# Altium project AMC_FMC_Carrier.PrjPcb (part 7 of 7)

## Sheet SUP_1.5_VTT.SchDoc
size A4
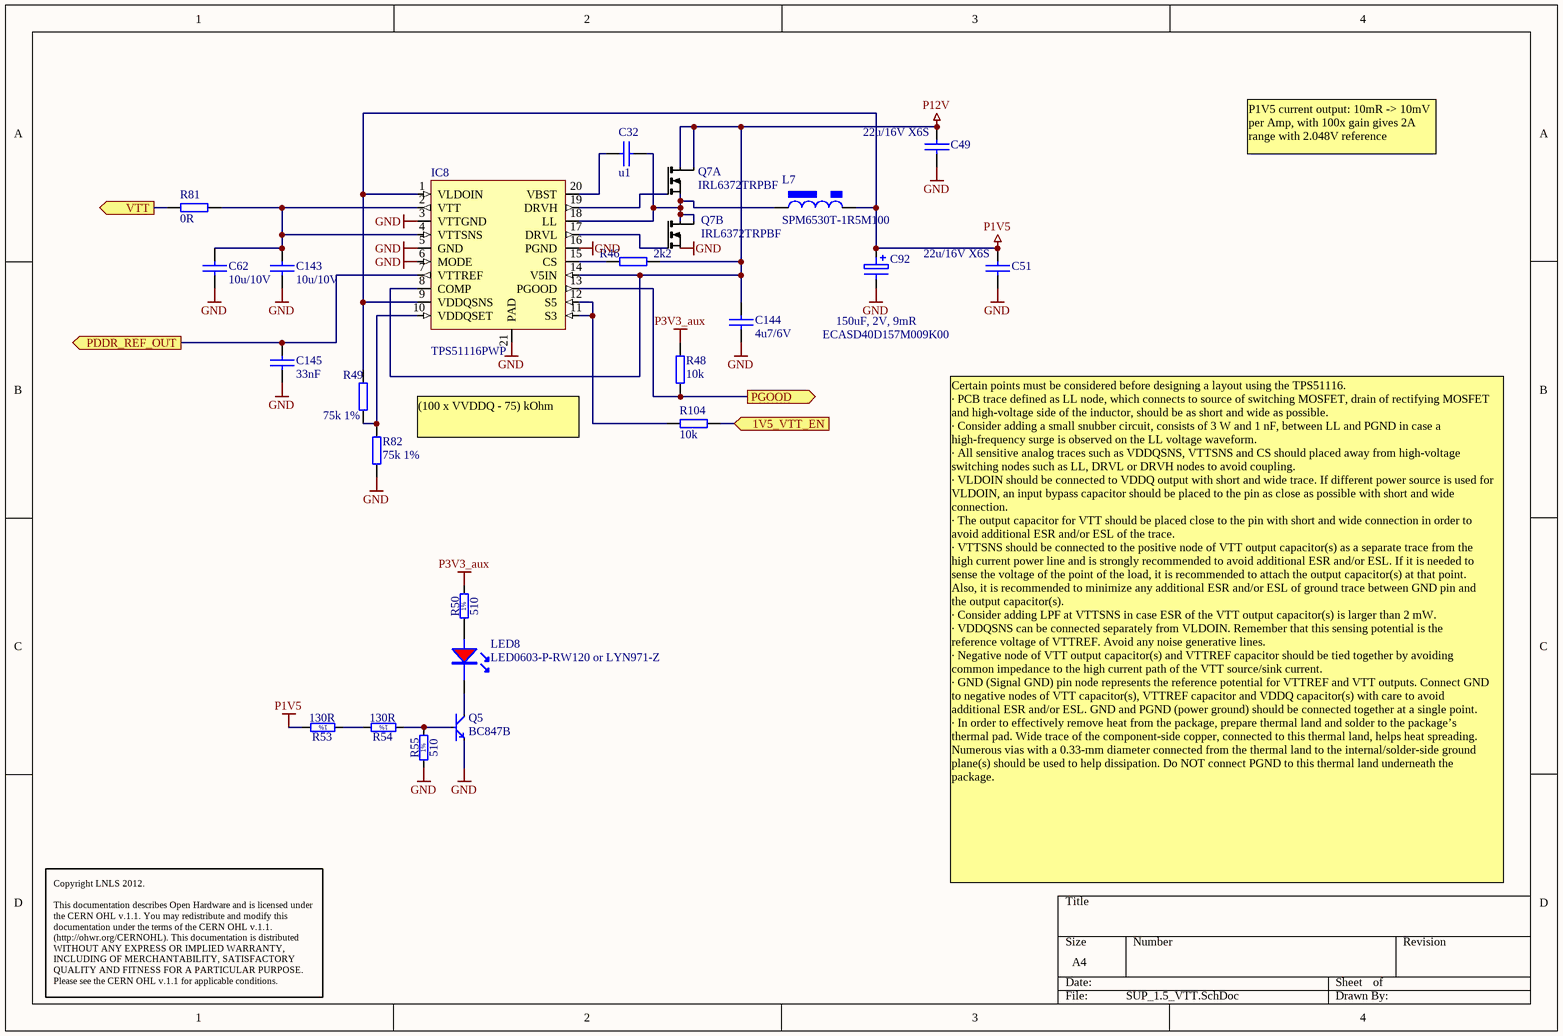
[diagram p20: SUP_1.5_VTT.SchDoc]

### Parts
(Parts that share a designator on the sheet are numbered #1, #2 ... from top to bottom, then left to right.)
C32  u1  [0402C]
C49  22u/16V X6S  [1206C]
C51  22u/16V X6S  [1206C]
C62  10u/10V  [0805C]
C92  ECASD40D157M009K00  value 150uF, 2V, 9mR  [2917_POLY]
C143  10u/10V  [0805C]
C144  4u7/6V  [0603C]
C145  33nF  [0603C]
IC8#2  TPS51116PWP  [TSSOP20-TP]
L7  SPM6530T-1R5M100  [IND_TDK_SPM6530]
LED8  LED0603-P-RW120 or LYN971-Z  [led_0603R]
Q5#2  BC847B  [SOT-23]
Q7  IRL6372TRPBF  [so-8]  (parts A,B of 2)
R46#2  2k2  [0402R]
R48#2  10k  [0402R]
R49#2  75k 1%  [0603R]
R50#2  510  [0603R]
R53#2  130R  [0603R]
R54#2  130R  [0603R]
R55#2  510  [0603R]
R81#2  0R  [0603R]
R82#2  75k 1%  [0603R]
R104#2  10k  [0402R]

### Ports
1V5_VTT_EN (in), PDDR_REF_OUT (out), PGOOD (out), VTT (out)

### Nets
GND: C49.2 C51.2 C62.2 C92.2 C143.2 C144.2 C145.2 IC8#2.3(VTTGND) IC8#2.5(GND) IC8#2.6(MODE) IC8#2.16(PGND) IC8#2.21(PAD) Q5#2.2(E) Q7.3(S2) R55#2.1 R82#2.1
P1V5: C51.1 C92.1 IC8#2.1(VLDOIN) IC8#2.9(VDDQSNS) L7.2 R49#2.1 R53#2.2
P3V3_aux: R48#2.2 R50#2.2
P12V: C49.1 C144.1 IC8#2.8(COMP) IC8#2.14(V5IN) Q7.7(D1) Q7.8(D1) R46#2.2
1V5_VTT_EN: R104#2.2 ; port 1V5_VTT_EN
PDDR_REF_OUT: C145.1 IC8#2.7(VTTREF) ; port PDDR_REF_OUT
PGOOD: IC8#2.13(PGOOD) R48#2.1 ; port PGOOD
VTT: R81#2.1 ; port VTT
NetC32_1: C32.1 IC8#2.20(VBST)
NetC32_2: C32.2 IC8#2.18(LL) L7.1 Q7.1(S1) Q7.5(D2) Q7.6(D2)
NetC62_1: C62.1 C143.1 IC8#2.2(VTT) IC8#2.4(VTTSNS) R81#2.2
NetIC8#2_10: IC8#2.10(VDDQSET) R49#2.2 R82#2.2
NetIC8#2_11: IC8#2.11(S3) IC8#2.12(S5) R104#2.1
NetIC8#2_15: IC8#2.15(CS) R46#2.1
NetIC8#2_17: IC8#2.17(DRVL) Q7.4(G2)
NetIC8#2_19: IC8#2.19(DRVH) Q7.2(G1)
NetLED8_A: LED8.A R50#2.1
NetLED8_K: LED8.K Q5#2.3(C)
NetQ5#2_1: Q5#2.1(B) R54#2.1 R55#2.2
NetR53#2_1: R53#2.1 R54#2.2

### Notes on the sheet
- P1V5 current output: 10mR -> 10mV per Amp, with 100x gain gives 2A range with 2.048V reference
- (100 x VVDDQ - 75) kOhm
- Certain points must be considered before designing a layout using the TPS51116.
  · PCB trace defined as LL node, which connects to source of switching MOSFET, drain of rectifying MOSFET
  and high-voltage side of the inductor, should be as short and wide as possible.
  · Consider adding a small snubber circuit, consists of 3 W and 1 nF, between LL and PGND in case a
  high-frequency surge is observed on the LL voltage waveform.
  · All sensitive analog traces such as VDDQSNS, VTTSNS and CS should placed away from high-voltage
  switching nodes such as LL, DRVL or DRVH nodes to avoid coupling.
  · VLDOIN should be connected to VDDQ output with short and wide trace. If different power source is used for
  VLDOIN, an input bypass capacitor should be placed to the pin as close as possible with short and wide
  connection.
  · The output capacitor for VTT should be placed close to the pin with short and wide connection in order to
  avoid additional ESR and/or ESL of the trace.
  · VTTSNS should be connected to the positive node of VTT output capacitor(s) as a separate trace from the
  high current power line and is strongly recommended to avoid additional ESR and/or ESL. If it is needed to
  sense the voltage of the point of the load, it is recommended to attach the output capacitor(s) at that point.
  Also, it is recommended to minimize any additional ESR and/or ESL of ground trace between GND pin and
  the output capacitor(s).
  · Consider adding LPF at VTTSNS in case ESR of the VTT output capacitor(s) is larger than 2 mW.
  · VDDQSNS can be connected separately from VLDOIN. Remember that this sensing potential is the
  reference voltage of VTTREF. Avoid any noise generative lines.
  · Negative node of VTT output capacitor(s) and VTTREF capacitor should be tied together by avoiding
  common impedance to the high current path of the VTT source/sink current.
  · GND (Signal GND) pin node represents the reference potential for VTTREF and VTT outputs. Connect GND
  to negative nodes of VTT capacitor(s), VTTREF capacitor and VDDQ capacitor(s) with care to avoid
  additional ESR and/or ESL. GND and PGND (power ground) should be connected together at a single point.
  · In order to effectively remove heat from the package, prepare thermal land and solder to the package’s
  thermal pad. Wide trace of the component-side copper, connected to this thermal land, helps heat spreading.
  Numerous vias with a 0.33-mm diameter connected from the thermal land to the internal/solder-side ground
  plane(s) should be used to help dissipation. Do NOT connect PGND to this thermal land underneath the
  package.
- Copyright LNLS 2012.
  This documentation describes Open Hardware and is licensed under the CERN OHL v.1.1. You may redistribute and modify this documentation under the terms of the CERN OHL v.1.1. (http://ohwr.org/CERNOHL). This documentation is distributed WITHOUT ANY EXPRESS OR IMPLIED WARRANTY, INCLUDING OF MERCHANTABILITY, SATISFACTORY QUALITY AND FITNESS FOR A PARTICULAR PURPOSE. Please see the CERN OHL v.1.1 for applicable conditions.
- (in symbol R0402_510R_1%_0.0625W_100PPM) 1%
- (in symbol R0603_130R_1%_0.1W_100PPM) 1%

### Library data of the parts
C32 = CAP_SMD_0402: Capacitor SMD
C49 C51 = CAP_SMD_1206: Capacitor SMD; Supplier 1: Newark; Supplier Part Number 1: 90R7810
C62 C143 = CAP_SMD_0805: Capacitor SMD
C92 = CAP_POLYMER_SMDD: POLY, 150uF, 2V, ESR: 9mR
C144 C145 = CAP_SMD_0603: Capacitor SMD
IC8#2 = PM_TPS51116: COMPLETE DDR AND DDR2 MEMORY POWER SOLUTION
L7 = L_POWER_SPM6530T: 1.5uH, 20%, 10mR, 11.5A; Supplier 1: Arrow; Supplier Part Number 1: 51419938S48550N1165
LED8 = LED_0603R: LED 0603 red; Supplier 1: Newark; Supplier Part Number 1: 22M3004; Supplier 2: Newark; Supplier Part Number 2: 20M0618
Q5#2 = Q_BC847B: Transistor
Q7 = Q_IRL6372: dual NMOS 30V, 8A, 18mR
R46#2 R48#2 R104#2 = RES_0402: SMD Resistor; Supplier 1: Newark; Supplier Part Number 1: 59M6691
R49#2 R81#2 R82#2 = RES_0603: SMD Resistor
R50#2 R55#2 = R0402_510R_1%_0.0625W_100PPM: Resistor - 1%; Part Description: General Purpose Thick Film Chip Resistor; Manufacturer: GENERIC; Manufacturer1 Part Number: 232270675101; TC: ±100ppm/°C; Table: Resistors SMD; Part Number: R0402_510R_1%_0.0625W_100PPM; Component Kind: Standard; Component Type: Standard; Footprint: RESC1005X40N; Pin Count: 2; Value: 510; Status: Not recommended; Power: 0.0625W; Tolerance: ±1%; Manufacturer Part Number: R0402_510R_1%_0.0625W_100PPM; Case: 0402; Mounted: Yes; Socket: No; SMD: Yes; Manufacturer1 Example: PHYCOMP; Manufacturer1 ComponentHeight: 0.4mm; HelpURL: \\cern.ch\dfs\Applications\Altium\Datasheets\R0402_Phycomp_RC0402.pdf; Author: CERN DEM JLC; CreateDate: 2007-12-03; LatestRevisionDate: 2008-03-13
R53#2 R54#2 = R0603_130R_1%_0.1W_100PPM: Resistor - 1%; Part Description: General Purpose Thick Film Chip Resistor; Manufacturer: GENERIC; Manufacturer1 Part Number: NRC06F1300TRF; Value: 130; Power: 0.1W; TC: ±100ppm/°C; Table: Resistors SMD; Part Number: R0603_130R_1%_0.1W_100PPM; Component Kind: Standard; Component Type: Standard; Footprint: RESC1608X55N; Pin Count: 2; Status: Preferred; Tolerance: ±1%; Manufacturer Part Number: R0603_130R_1%_0.1W_100PPM; Case: 0603; Mounted: Yes; Socket: No; SMD: Yes; Manufacturer1 Example: NIC COMPONENT; Manufacturer1 ComponentHeight: 0.55mm; HelpURL: \\cern.ch\dfs\Applications\Altium\Datasheets\R0603_NIC_NRC.pdf; Author: CERN DEM JLC; CreateDate: 2007-12-03; LatestRevisionDate: 2008-03-13

## Nets that join several sheets
GND: AMC_Connector (61 pins), FPGA (18 pins), FPGA_SDRAM (5 pins), Power_Management (6 pins), SUP_2.5_FMC (38 pins), SUP_3.3_FMC (34 pins), SUP_1.5_3.3 (44 pins), SUP_1V (40 pins), UI_mon (14 pins), Connector_Power (11 pins), IPMI (13 pins), CPU (41 pins), Thermometers (16 pins), IPMI/UUART (13 pins), JTAG_Configuration (39 pins), RTM_CON (89 pins), Clock_management (58 pins), Clock_WR (31 pins), UUART (13 pins), FMC_Clocks (8 pins), SUP_1.5_VTT (16 pins)
P1V0: SUP_1V (23 pins), UI_mon (L?#1.1)
P1V5: FPGA (C774.1 IC71.1 IC71.8), SUP_1.5_3.3 (11 pins), SUP_1.5_VTT (7 pins)
P3V3: FPGA (21 pins), SUP_1.5_3.3 (11 pins), UI_mon (R?#7.2), Connector_Power (R343.1 R344.1), JTAG_Configuration (R164.2 R225.2), Clock_management (10 pins), Clock_WR (5 pins)
P3V3MP: AMC_Connector (D?#1.5 D?#2.5 D?#3.5 P1.4), Power_Management (F?#1.1), SUP_2.5_FMC (C475.2 C476.1 IC11.6 IC11.11), SUP_1.5_3.3 (R76.1), SUP_1V (R110.2), UI_mon (L17.1), Connector_Power (6 pins), IPMI (10 pins), CPU (50 pins), Thermometers (19 pins), JTAG_Configuration (14 pins), Clock_management (C766.1 IC56.2)
P12V: AMC_Connector (8 pins), Power_Management (C88.1 D5.1), SUP_2.5_FMC (11 pins), SUP_3.3_FMC (11 pins), SUP_1.5_3.3 (11 pins), SUP_1V (18 pins), UI_mon (R?#6.2), Connector_Power (12 pins), SUP_1.5_VTT (7 pins)
PVADJ1: FPGA (6 pins), SUP_2.5_FMC (5 pins)
PVADJ2: FPGA (C773.1 IC70.1 IC70.8), SUP_2.5_FMC (5 pins), Clock_management (7 pins)
VREF: FPGA_SDRAM (8 pins), SUP_1.5_3.3 (C548.2 IC44.6)
VTT: FPGA_SDRAM (R143.1 R181.1), SUP_1.5_3.3 (C544.2 C545.2 IC44.3 R286.1)
AJTAG.TCK: AMC_Connector (D?#1.6 P1.165), JTAG_Configuration (R231.1)
AJTAG.TDI: AMC_Connector (D?#1.1 P1.169), JTAG_Configuration (R230.1)
AJTAG.TDO: AMC_Connector (D?#1.4 P1.168), JTAG_Configuration (R229.1)
AJTAG.TMS: AMC_Connector (D?#2.1 P1.166), JTAG_Configuration (R227.1)
AJTAG.TRST#: AMC_Connector (D?#2.3 P1.167), JTAG_Configuration (R226.1)
EN_I2C_RTM: IPMI (IC72.8 R121.2), CPU (IC6.30)
FCLKA_N: AMC_Connector (P1.81), Clock_management (C395.1)
FCLKA_P: AMC_Connector (P1.80), Clock_management (C393.1)
FJTAG.TCK: FPGA (IC2#1.AE12), JTAG_Configuration (IC47.59 R164.1)
FJTAG.TDI: FPGA (IC2#1.AE14), JTAG_Configuration (IC47.55)
FJTAG.TDO: FPGA (IC2#1.AD13), JTAG_Configuration (IC47.56)
FJTAG.TMS: FPGA (IC2#1.AE13), JTAG_Configuration (IC47.57 R225.1)
FPGA_ALERTn: CPU (IC6.52), Thermometers (6 pins)
FPGA_BOOT_CLK_IN: FPGA_SDRAM (R311.2), Clock_WR (R51.2)
FPGA_SCL: IPMI (IC79.19), CPU (IC6.49 R348.2)
FPGA_SDA: IPMI (IC79.20), CPU (IC6.48 R347.2)
FSPI.DONE: FPGA (IC2#1.P11 Q9.1 R161.1), CPU (R153.2)
FSPI.FLASH_Q/D1: FPGA (R298.2), CPU (R156.1)
FSPI.FLASH_SI/D0: FPGA (R291.1), CPU (R157.1)
FSPI.FPGA_CCLK: FPGA (IC2#1.W11 R294.1), CPU (R155.1)
FSPI.INIT_B: FPGA (IC2#1.V11 R131.2), CPU (R346.1)
FSPI.MISO1: FPGA (R296.2), CPU (R150.2)
FSPI.MOSI1: FPGA (R292.1), CPU (R151.2)
FSPI.PROGRAM_B: FPGA (IC2#1.N11 R160.1), CPU (R152.2)
FSPI.SCK1: FPGA (R295.1), CPU (R148.2)
FSPI.SSEL1: FPGA (R300.1), CPU (R149.2)
FTMP.DXN: FPGA (IC2#1.W17), Thermometers (R135.1)
FTMP.DXP: FPGA (IC2#1.W18), Thermometers (IC18.3)
I2C_CPU.SCL: UI_mon (IC?#2.6 IC?#3.6 IC?#4.6 R147.1), IPMI (IC79.11), CPU (IC6.47 R176.2), Thermometers (5 pins), Clock_management (IC56.3)
I2C_CPU.SDA: UI_mon (5 pins), IPMI (IC79.10), CPU (IC6.46 R174.2), Thermometers (5 pins), Clock_management (IC56.4)
I2C_Si57.SCL: IPMI (IC79.6), Clock_management (IC42.7 R68.2), Clock_WR (OSC?.8 R220.1)
I2C_Si57.SDA: IPMI (IC79.5), Clock_management (IC42.6 R67.2), Clock_WR (OSC?.7 R272.1)
I_FMC1_P3V3n: SUP_3.3_FMC (R?#4.E1), UI_mon (IC?#2.15)
I_FMC1_P3V3p: SUP_3.3_FMC (R?#4.E2), UI_mon (IC?#2.14)
I_FMC1_PADJn: SUP_2.5_FMC (R?#2.E1), UI_mon (IC?#2.2)
I_FMC1_PADJp: SUP_2.5_FMC (R?#2.E2), UI_mon (IC?#2.1)
I_FMC2_P3V3n: SUP_3.3_FMC (R?#3.E1), UI_mon (IC?#3.15)
I_FMC2_P3V3p: SUP_3.3_FMC (R?#3.E2), UI_mon (IC?#3.14)
I_FMC2_PADJn: SUP_2.5_FMC (R?#1.E1), UI_mon (IC?#3.2)
I_FMC2_PADJp: SUP_2.5_FMC (R?#1.E2), UI_mon (IC?#3.1)
IO0_33: FPGA (IC71.3), FPGA_SDRAM (IC2#2.AC11)
IO17N_32: FPGA (IC71.5), FPGA_SDRAM (IC2#2.AN6)
IO17P_32: FPGA (IC71.4), FPGA_SDRAM (IC2#2.AN7)
IO25_33: FPGA (IC71.2), FPGA_SDRAM (IC2#2.AF10)
IPMB.ENABLE#: AMC_Connector (D?#3.3 P1.41), CPU (Q15.2)
IPMB.IPMB_GA0: AMC_Connector (D?#3.6 P1.5), CPU (R7#2.1 R20.1)
IPMB.IPMB_GA1: AMC_Connector (D?#3.4 P1.17), CPU (R8.1 R21.1)
IPMB.IPMB_GA2: AMC_Connector (D?#3.1 P1.26), CPU (R9.1 R22.1)
ISP_RST#: CPU (IC46.3 Q15.1 R2.2), IPMI/UUART (R31A.1)
MMC_TCK: CPU (JP2.4), JTAG_Configuration (IC47.71)
MMC_TDI: CPU (JP2.8), JTAG_Configuration (IC47.67)
MMC_TDO: CPU (JP2.6), JTAG_Configuration (IC47.69)
MMC_TMS: CPU (JP2.2), JTAG_Configuration (IC47.70)
MMC_TRST_L: CPU (JP2.10), JTAG_Configuration (IC47.72)
MOD_HANDLE: IPMI (PB1.1 PB1.2), CPU (IC6.50)
PLL_DAC_DIN: Clock_management (IC41.18), Clock_WR (IC82.7)
PLL_DAC_SCLK: Clock_management (IC41.20), Clock_WR (IC82.6)
PM.1V5_VTT_EN: SUP_1.5_3.3 (IC43.24 R49#1.1), CPU (IC?#5.6)
PM.DAC_VADJ_CLK: SUP_2.5_FMC (IC11.9), CPU (IC6.62)
PM.DAC_VADJ_CSn: SUP_2.5_FMC (IC11.7), CPU (IC6.63)
PM.DAC_VADJ_RSTn: SUP_2.5_FMC (IC11.10), CPU (IC6.57)
PM.DAC_VADJ_SDI: SUP_2.5_FMC (IC11.8), CPU (IC6.60)
PM.EN_FMC1_P3V3: SUP_3.3_FMC (IC12.7 R92.1), CPU (IC?#5.16)
PM.EN_FMC1_P12V: Connector_Power (Q3.1 R39.2), CPU (IC?#5.15)
PM.EN_FMC1_PVADJ: SUP_2.5_FMC (IC10.7 R78.1), CPU (IC?#5.19)
PM.EN_FMC2_P3V3: SUP_3.3_FMC (IC12.24 R85.1), CPU (IC?#6.5)
PM.EN_FMC2_P12V: Connector_Power (Q4.1 R40.2), CPU (IC?#6.2)
PM.EN_FMC2_PVADJ: SUP_2.5_FMC (IC10.24 R71.1), CPU (IC?#6.6)
PM.EN_P1V0: SUP_1V (IC14.2 R114.2), CPU (IC?#5.2)
PM.EN_P3V3: SUP_1.5_3.3 (IC43.7 R69.1), CPU (IC?#5.12)
PM.EN_RTM_3V3MP: Connector_Power (Q14#2.1 R305#2.2), CPU (IC?#6.16)
PM.EN_RTM_PWR: Connector_Power (Q14#1.1 R305#1.2), CPU (IC?#6.9)
PM.PGOOD_P1V0: SUP_1.5_3.3 (IC44.9), SUP_1V (IC14.3 R110.1), CPU (IC6.26)
PROG_RxD: CPU (IC6.99), IPMI/UUART (R275A.1)
PROG_TxD: CPU (IC6.98), IPMI/UUART (R276A.1)
RESETn: CPU (IC6.36), Clock_management (IC8#1.1)
RTM_LVDS.RTM_LVD3_N: FPGA (R323.1), RTM_CON (J1.f5)
RTM_LVDS.RTM_LVD3_P: FPGA (R322.1), RTM_CON (J1.e5)
RTM_LVDS.RTM_LVD4_N: FPGA (R324.1), RTM_CON (J1.b5)
RTM_LVDS.RTM_LVD4_P: FPGA (R325.1), RTM_CON (J1.a5)
RTM_PS#: CPU (IC6.27), RTM_CON (J1.c1)
RTM_SCL: IPMI (IC72.3 IC79.8 R36.1), RTM_CON (J1.d2)
RTM_SDA: IPMI (IC72.4 IC79.7 R119.1), RTM_CON (J1.d1)
RTM_SYNC_CLK_N: RTM_CON (J1.b3), Clock_management (C814.2)
RTM_SYNC_CLK_P: RTM_CON (J1.a3), Clock_management (C813.2)
RTM_TCK: JTAG_Configuration (IC47.92), RTM_CON (J1.e1)
RTM_TDI: JTAG_Configuration (IC47.91), RTM_CON (J1.e2)
RTM_TDO: JTAG_Configuration (IC47.90), RTM_CON (J1.f1)
RTM_TMS: JTAG_Configuration (IC47.89), RTM_CON (J1.f2)
SI57X_CLK_N: Clock_management (C403.1), Clock_WR (IC48.5 OSC?.5)
SI57X_CLK_P: Clock_management (C401.1), Clock_WR (IC48.6 OSC?.4)
SI57X_OE: Clock_management (IC41.17), Clock_WR (OSC?.2 R223.1)
SW: IPMI (S1.1), CPU (IC6.51)
TCLKA_N: AMC_Connector (P1.75), Clock_management (C458.1 C482.2)
TCLKA_P: AMC_Connector (P1.74), Clock_management (C414.1 C480.2)
TCLKB_N: AMC_Connector (P1.78), Clock_management (C462.1 C486.2)
TCLKB_P: AMC_Connector (P1.77), Clock_management (C460.1 C484.2)
TCLKC_N: AMC_Connector (P1.135), Clock_management (C477.1 C490.2)
TCLKC_P: AMC_Connector (P1.136), Clock_management (C464.1 C488.2)
TCLKD_N: AMC_Connector (P1.138), Clock_management (C481.1 C494.2)
TCLKD_P: AMC_Connector (P1.139), Clock_management (C479.1 C492.2)
UI_MON.INA_CRITICAL: UI_mon (IC?#2.9 IC?#3.9 IC?#4.9 R?#5.1), CPU (IC6.39)
UI_MON.MEAS_1V2: UI_mon (C?#3.2 L?#2.2), CPU (IC6.6)
UI_MON.MEAS_3v3: UI_mon (C?#2.2 R?#7.1 R?#9.2), CPU (IC6.7)
UI_MON.MEAS_12V: UI_mon (C?#1.2 R?#6.1 R?#8.2), CPU (IC6.9)
UPDATEn: CPU (IC6.40), Clock_management (R139.2)

## Assembly variants
LNLS: not fitted IC46 IC47 IC49 IC66 J3 J8 J9 J10